# Altium schematic sheet ESP.SchDoc
size 420 x 297 mm; Organization: Altium Limited; Address1: L3, 12a Rodborough Rd; Address2: Frenchs Forest; Address3: NSW; Address4: Australia 2086
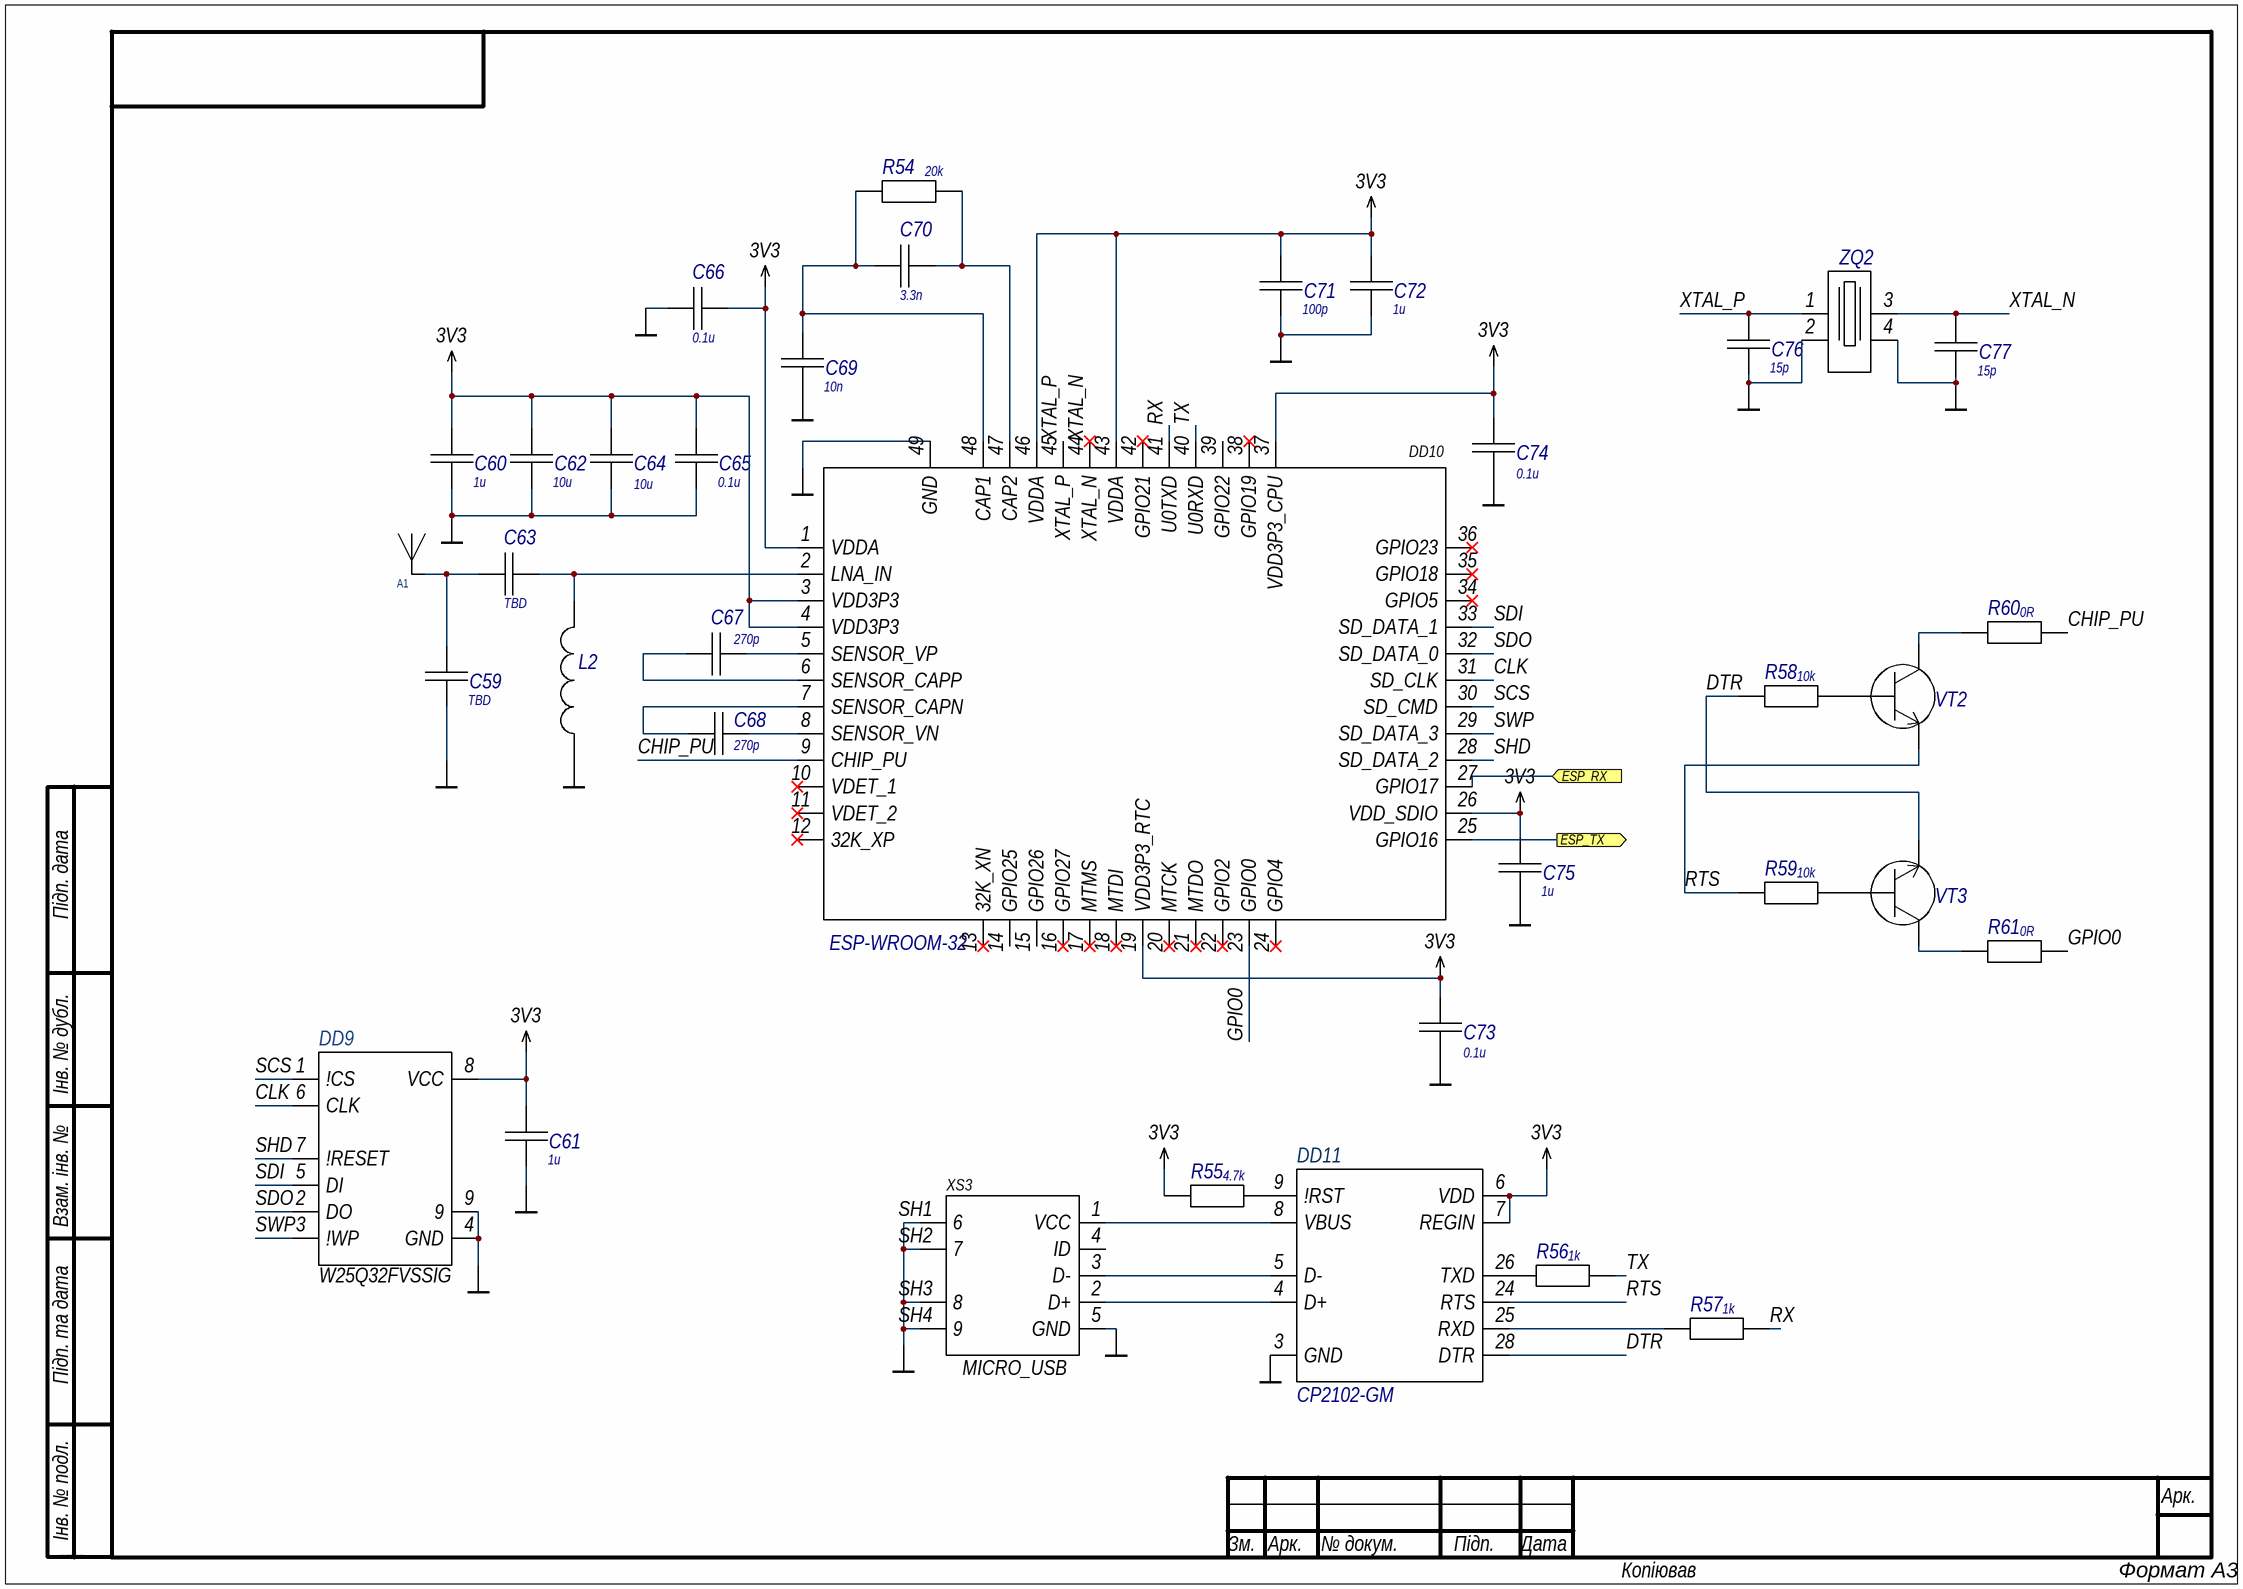
[diagram p0: ESP.SchDoc]

## Parts
A1  Antenna-1-Pin  [PCB_ANT]  (value not drawn)  (net tie)
C59  value TBD  [C_0603]
C60  value 1u  [C_0603]
C61  value 1u  [C_0603]
C62  value 10u  [C_0603]
C63  value TBD  [C_0603]
C64  value 10u  [C_0603]
C65  value 0.1u  [C_0603]
C66  value 0.1u  [C_0603]
C67  value 270p  [C_0603]
C68  value 270p  [C_0603]
C69  value 10n  [C_0603]
C70  value 3.3n  [C_0603]
C71  value 100p  [C_0603]
C72  value 1u  [C_0603]
C73  value 0.1u  [C_0603]
C74  value 0.1u  [C_0603]
C75  value 1u  [C_0603]
C76  value 15p  [C_0603]
C77  value 15p  [C_0603]
DD9  W25Q32FVSSIG  [W25QxxxJVEIQ-127P800X80_MED]
DD10  Name: ESP-WROOM-32  (hidden comment: ESP-WROOM-32 Espressif Systems)
DD11  CP2102-GM  [QFN-28_5x5mm]
L2  (no value)  [FB0603]
R54  value 20k  [R0_0603]  (hidden comment: 0603 0 В 20k 1% Keystone Electronics)
R55  value 4.7k  [R0_0603]  (hidden comment: 0603 0 В 4.7k 1% Keystone Electronics)
R56  value 1k  [R0_0603]  (hidden comment: 0603 0 В 1k 1% Keystone Electronics)
R57  value 1k  [R0_0603]  (hidden comment: 0603 0 В 1k 1% Keystone Electronics)
R58  value 10k  [R0_0603]  (hidden comment: 0603 0 В 10k 1% Keystone Electronics)
R59  value 10k  [R0_0603]  (hidden comment: 0603 0 В 10k 1% Keystone Electronics)
R60  value 0R  [R0_0603]  (hidden comment: 0603 0 В 0R 1% Keystone Electronics)
R61  value 0R  [R0_0603]  (hidden comment: 0603 0 В 0R 1% Keystone Electronics)
VT2  (no value)  [SOT-23]
VT3  (no value)  [SOT-23]
XS3  MICRO_USB  [MICRO_USB]
ZQ2  (no value)  [O2_768KHZ]

## Ports
ESP_RX (in), ESP_TX (out)

## Nets
3V3: C60.2 C61.2 C62.2 C64.1 C65.2 C66.1 C71.2 C72.2 C73.1 C74.1 C75.2 DD9.8(VCC) DD10.1(VDDA) DD10.3(VDD3P3) DD10.4(VDD3P3) DD10.19(VDD3P3_RTC) DD10.26(VDD_SDIO) DD10.37(VDD3P3_CPU) DD10.43(VDDA) DD10.46(VDDA) DD11.6(VDD) DD11.7(REGIN) R55.1
GND: C59.1 C60.1 C61.1 C62.1 C64.2 C65.1 C66.2 C69.1 C71.1 C72.1 C73.2 C74.2 C75.1 C76.1 C77.1 DD9.4(GND) DD9.9 DD10.49(GND) DD11.3(GND) L2.1 XS3.5(GND) XS3.SH1(6) XS3.SH2(7) XS3.SH3(8) XS3.SH4(9) ZQ2.2 ZQ2.4
CHIP_PU: DD10.9(CHIP_PU) R60.2
CLK: DD9.6(CLK) DD10.31(SD_CLK)
DTR: DD11.28(DTR) R58.1 VT3.2
ESP_RX: DD10.27(GPIO17) ; port ESP_RX
ESP_TX: DD10.25(GPIO16) ; port ESP_TX
GPIO0: DD10.23(GPIO0) R61.2
RTS: DD11.24(RTS) R59.1 VT2.2
RX: DD10.41(U0TXD) R57.2
SCS: DD9.1(!CS) DD10.30(SD_CMD)
SDI: DD9.5(DI) DD10.33(SD_DATA_1)
SDO: DD9.2(DO) DD10.32(SD_DATA_0)
SHD: DD9.7(!RESET) DD10.28(SD_DATA_2)
SWP: DD9.3(!WP) DD10.29(SD_DATA_3)
TX: DD10.40(U0RXD) R56.2
XTAL_N: C77.2 DD10.44(XTAL_N) ZQ2.3
XTAL_P: C76.2 DD10.45(XTAL_P) ZQ2.1
NetA1_1: A1.1 C59.2 C63.2
NetC63_1: C63.1 DD10.2(LNA_IN) L2.2
NetC67_1: C67.1 DD10.5(SENSOR_VP)
NetC67_2: C67.2 DD10.6(SENSOR_CAPP)
NetC68_1: C68.1 DD10.8(SENSOR_VN)
NetC68_2: C68.2 DD10.7(SENSOR_CAPN)
NetC69_2: C69.2 C70.2 DD10.48(CAP1) R54.1
NetC70_1: C70.1 DD10.47(CAP2) R54.2
NetDD11_4: DD11.4(D+) XS3.2(D+)
NetDD11_5: DD11.5(D-) XS3.3(D-)
NetDD11_8: DD11.8(VBUS) XS3.1(VCC)
NetDD11_9: DD11.9(!RST) R55.2
NetDD11_25: DD11.25(RXD) R57.1
NetDD11_26: DD11.26(TXD) R56.1
NetR58_2: R58.2 VT2.3
NetR59_2: R59.2 VT3.3
NetR60_1: R60.1 VT2.1
NetR61_1: R61.1 VT3.1

Not connected (* = marked no-connect by the designer): DD10 10(VDET_1)* 11(VDET_2)* 12(32K_XP)* 13(32K_XN)* 14(GPIO25) 15(GPIO26) 16(GPIO27)* 17(MTMS)* 18(MTDI)* 20(MTCK)* 21(MTDO)* 22(GPIO2)* 24(GPIO4)* 34(GPIO5)* 35(GPIO18)* 36(GPIO23)* 38(GPIO19)* 39(GPIO22) 42(GPIO21)*; XS3 4(ID)

## Notes on the sheet
- Підп. дата
- Інв. № дубл.
- Взам. інв. №
- Підп. та дата
- Інв. № подл.
- Зм.
- Арк.
- № докум.
- Підп.
- Дата
- ALTIUM GOSTBOM2.0 KEV
- Копіював
- Формат А3

## Library data of the parts
A1 = Antenna-1-Pin: SMA, Through-Hole
C59-C77 = C_0603: Manufacturer: TDK Corporation; Temp_Coef: X7R; Voltage: 50 В; Tolerance: 10%; Package: 0603
DD9 = W25Q256JVEI1: FLASH - NOR Memory IC 256Mb SPI - Quad I/O, QPI 133 MHz 8-WSON; Manufacturer: Winbond Electronics; Package: SOIC-8; Part Number: W25Q32FVSSIG
DD10 = ESP32-DOWDQ6: Manufacturer: Espressif Systems
DD11 = CP2102-GM: USB 2.0 to UART, 28-QFN (5x5); Manufacturer: Silicon Labs; Package: QFN-28 Silicon Labs; Part Number: CP2102-GM
L2 = induction: Manufacturer: TAI-TECH Advanced Electronics Co., Ltd.; Name: FCM 1608KF-601T03
R54-R61 = R_0603: Power: 0 В; Package: 0603; Tolerance: 1%; Manufacturer: Keystone Electronics
VT2 VT3 = NPN: Manufacturer: onsemi; Name: MMBTA06LT1G
XS3 = MICRO_USB: Manufacturer: Amphenol ICC (FCI); Name: 10104110-0001LF
ZQ2 = CRYSTAL: 40MHz; Manufacturer: Abracon LLC; Name: ABS25-32.768KHZ-6-T